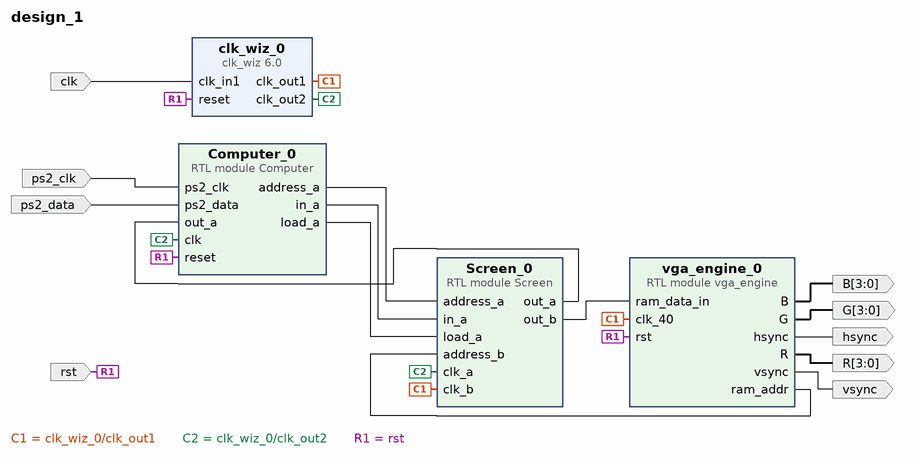
[diagram p0: block diagram of the top level]
# Vivado block design design_1, xc7a100tcsg324-1, Vivado 2024.1
create_bd_design design_1

create_bd_port -dir I -type clk clk
create_bd_port -dir I -type rst rst
set_property -dict {CONFIG.POLARITY ACTIVE_HIGH} [get_bd_ports rst]
create_bd_port -dir I -type clk ps2_clk
create_bd_port -dir I ps2_data
create_bd_port -dir O vsync
create_bd_port -dir O hsync
create_bd_port -dir O -from 3 -to 0 R
create_bd_port -dir O -from 3 -to 0 G
create_bd_port -dir O -from 3 -to 0 B

create_bd_cell -type module -reference Computer Computer_0
create_bd_cell -type ip -vlnv xilinx.com:ip:clk_wiz:6.0 clk_wiz_0
set_property -dict [list \
  CONFIG.CLKIN2_JITTER_PS 166.66 \
  CONFIG.CLKOUT1_JITTER 159.371 \
  CONFIG.CLKOUT1_REQUESTED_OUT_FREQ 40 \
  CONFIG.CLKOUT2_JITTER 130.958 \
  CONFIG.CLKOUT2_PHASE_ERROR 98.575 \
  CONFIG.CLKOUT2_USED true \
  CONFIG.MMCM_CLKIN2_PERIOD 10.000 \
  CONFIG.MMCM_CLKOUT0_DIVIDE_F 25.000 \
  CONFIG.MMCM_CLKOUT1_DIVIDE 10 \
  CONFIG.NUM_OUT_CLKS 2 \
  CONFIG.SECONDARY_SOURCE Single_ended_clock_capable_pin \
  CONFIG.USE_INCLK_SWITCHOVER false \
  CONFIG.USE_LOCKED false \
] [get_bd_cells clk_wiz_0]
create_bd_cell -type module -reference vga_engine vga_engine_0
create_bd_cell -type module -reference Screen Screen_0

# ---- connections ----

connect_bd_net -net Computer_0_B [get_bd_pins vga_engine_0/B] [get_bd_ports B]
connect_bd_net -net Computer_0_G [get_bd_pins vga_engine_0/G] [get_bd_ports G]
connect_bd_net -net Computer_0_R [get_bd_pins vga_engine_0/R] [get_bd_ports R]
connect_bd_net [get_bd_pins Computer_0/address_a] [get_bd_pins Screen_0/address_a]
connect_bd_net -net Computer_0_hsync [get_bd_pins vga_engine_0/hsync] [get_bd_ports hsync]
connect_bd_net [get_bd_pins Computer_0/in_a] [get_bd_pins Screen_0/in_a]
connect_bd_net [get_bd_pins Computer_0/load_a] [get_bd_pins Screen_0/load_a]
connect_bd_net -net Computer_0_vsync [get_bd_pins vga_engine_0/vsync] [get_bd_ports vsync]
connect_bd_net [get_bd_pins Screen_0/out_a] [get_bd_pins Computer_0/out_a]
connect_bd_net [get_bd_pins Screen_0/out_b] [get_bd_pins vga_engine_0/ram_data_in]
connect_bd_net -net clk_in1_0_1 [get_bd_ports clk] [get_bd_pins clk_wiz_0/clk_in1]
connect_bd_net [get_bd_pins clk_wiz_0/clk_out1] [get_bd_pins vga_engine_0/clk_40] [get_bd_pins Screen_0/clk_b]
connect_bd_net [get_bd_pins clk_wiz_0/clk_out2] [get_bd_pins Screen_0/clk_a] [get_bd_pins Computer_0/clk]
connect_bd_net -net ps2_clk_0_1 [get_bd_ports ps2_clk] [get_bd_pins Computer_0/ps2_clk]
connect_bd_net -net ps2_data_0_1 [get_bd_ports ps2_data] [get_bd_pins Computer_0/ps2_data]
connect_bd_net -net reset_0_1 [get_bd_ports rst] [get_bd_pins clk_wiz_0/reset] [get_bd_pins vga_engine_0/rst] [get_bd_pins Computer_0/reset]
connect_bd_net [get_bd_pins vga_engine_0/ram_addr] [get_bd_pins Screen_0/address_b]

validate_bd_design
save_bd_design
